# Altium schematic sheet top_level.SchDoc: Go Kart Control Board
size A4; Revision: 0.1
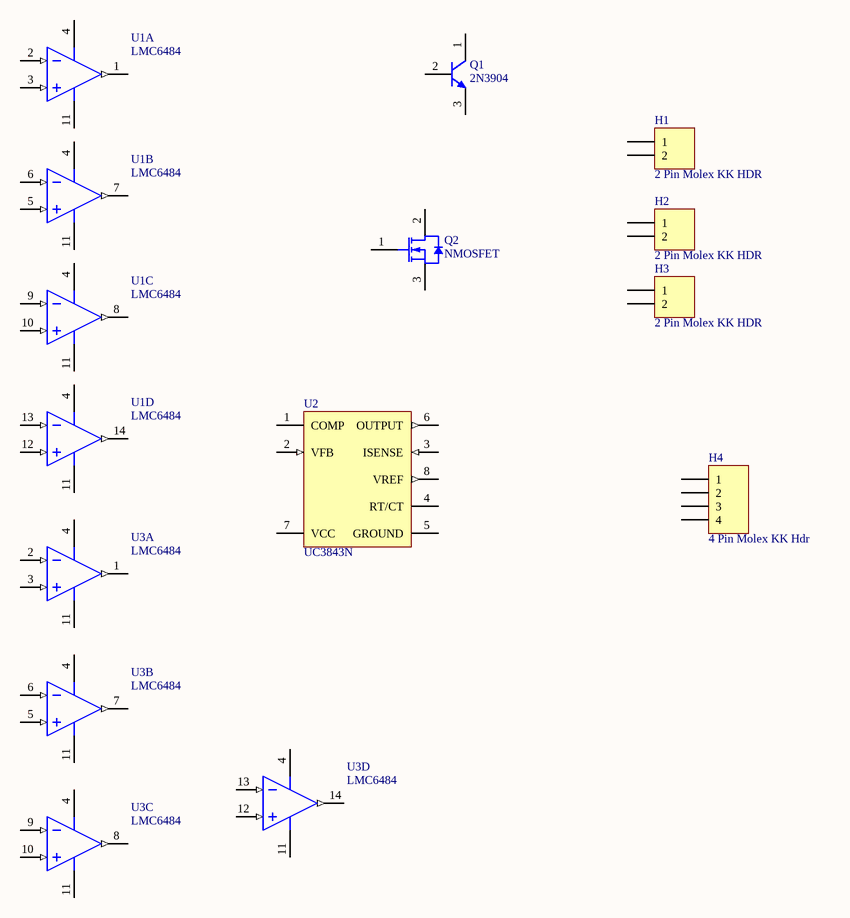
[diagram p0: top_level.SchDoc]

## Parts
H1  2 Pin Molex KK HDR  [MOLEX_KK_2_HDR]
H2  2 Pin Molex KK HDR  [MOLEX_KK_2_HDR]
H3  2 Pin Molex KK HDR  [MOLEX_KK_2_HDR]
H4  4 Pin Molex KK Hdr  [MOLEX_KK_4_HDR]
Q1  2N3904  [ONSC-TO-92-3-29-04_AD]
Q2  NMOSFET  [ONSC-TO-220-3-221A-09]
U1  LMC6484  [TI-J14]  (parts A,B,C,D of 4)
U2  UC3843N  [P8]
U3  LMC6484  [TI-J14]  (parts A,B,C,D of 4)

## Nets

Not connected (* = marked no-connect by the designer): H1 1 2; H2 1 2; H3 1 2; H4 1 2 3 4; Q1 1(C) 2(B) 3(E); Q2 1(G) 2(D) 3(S); U1 1(OUT1) 2(IN1-) 3(IN1+) 4(VCC+) 5(IN2+) 6(IN2-) 7(OUT2) 8(OUT3) 9(IN3-) 10(IN3+) 11(VCC-) 12(IN4+) 13(IN4-) 14(OUT4); U2 1(COMP) 2(VFB) 3(ISENSE) 4(RT/CT) 5(GROUND) 6(OUTPUT) 7(VCC) 8(VREF); U3 1(OUT1) 2(IN1-) 3(IN1+) 4(VCC+) 5(IN2+) 6(IN2-) 7(OUT2) 8(OUT3) 9(IN3-) 10(IN3+) 11(VCC-) 12(IN4+) 13(IN4-) 14(OUT4)

## Library data of the parts
H1-H3 = JA_MOLEX_KK_2POS: CONN HEADER 2POS 2.54mm VERT_Thru Hole; Supplier 1: Farnell; Supplier Part Number 1: 1462926; Supplier: ECE Dept; Storage Location: ECE Dept Store; Value: 2 Pin Molex KK HDR
H4 = JA_MOLEX_KK_4POS: CONN HEADER 4POS 2.54mm VERT_Thru Hole; Manufacturer: Molex; Manufacturer PN: 22-23-2041; Supplier Part Number 1: 9731164; Supplier: ECE Dept; Supplier 1: Farnell; Storage Location: ECE Dept Store; Value: 4 Pin Molex KK Hdr
U2 = UC3843N: PWM Controller with Current Control, 100 % Duty Cycle, 0 to +70 degC, 8-pin PDIP (P), Green (RoHS & no Sb/Br); Manufacturer: Texas Instruments; Duty Cycle(Max)(%): 100; Frequency(Max)(kHz): 450; Rating: Catalog; Regulated Outputs(#): 1; Topology: Boost, Buck, Flyback, Forward; UVLO Thresholds On/Off(V): 8.4/7.6; DatasheetVersion: SLUS223C; PackageVersion: revE, Apr-2010; PackageReference: P8; PackageDescription: 8-Pin Plastic Dual-In-Line Package, Row Spacing 7.62 mm, Pitch 2.54 mm; Supplier 1: Digi-Key; Supplier Part Number 1: 296-11288-5-ND; Supplier 2: Farnell; Supplier Part Number 2: 2164381; Supplier 3: Newark; Supplier Part Number 3: 74K4014; Supplier 4: Mouser; Supplier Part Number 4: 595-UC3843N; Control Method: Current; Eco-Plan: Green (RoHS & no Sb/Br); SubFamily: PWM Controller; Mounting Technology: Through Hole; PartNumber: UC3843N; Code_JEDEC: MS-001-BA; ComponentLink1Description: Datasheet; ComponentLink1URL: http://www.ti.com/general/docs/lit/getliterature.tsp?genericPartNumber=UC3843&fileType=pdf
Q1 = 2N3904: ComponentLink1Description: Manufacturer URL; ComponentLink1URL: http://www.onsemi.com/; ComponentLink2Description: Datasheet; ComponentLink2URL: http://www.onsemi.com/pub_link/Collateral/BC549B-D.PDF; ComponentLink3Description: Package Specification; ComponentLink3URL: http://www.onsemi.com/pub_link/Collateral/BC549B-D.PDF
Q2 = NMOSFET: ComponentLink1Description: Manufacturer URL; ComponentLink1URL: http://www.onsemi.com/; ComponentLink2Description: Datasheet; ComponentLink2URL: http://www.onsemi.com/pub_link/Collateral/NTD5862N-D.PDF; ComponentLink3Description: Package Specification; ComponentLink3URL: http://www.onsemi.com/pub_link/Collateral/221A-09.PDF
U1 U3 = LMC6484: ComponentLink1Description: Manufacturer URL; ComponentLink1URL: http://www.ti.com/; ComponentLink2Description: Datasheet; ComponentLink2URL: http://www.ti.com/lit/ds/symlink/tl064m.pdf; ComponentLink3Description: Package Specification; ComponentLink3URL: http://www.ti.com/litv/pdf/mcer002d